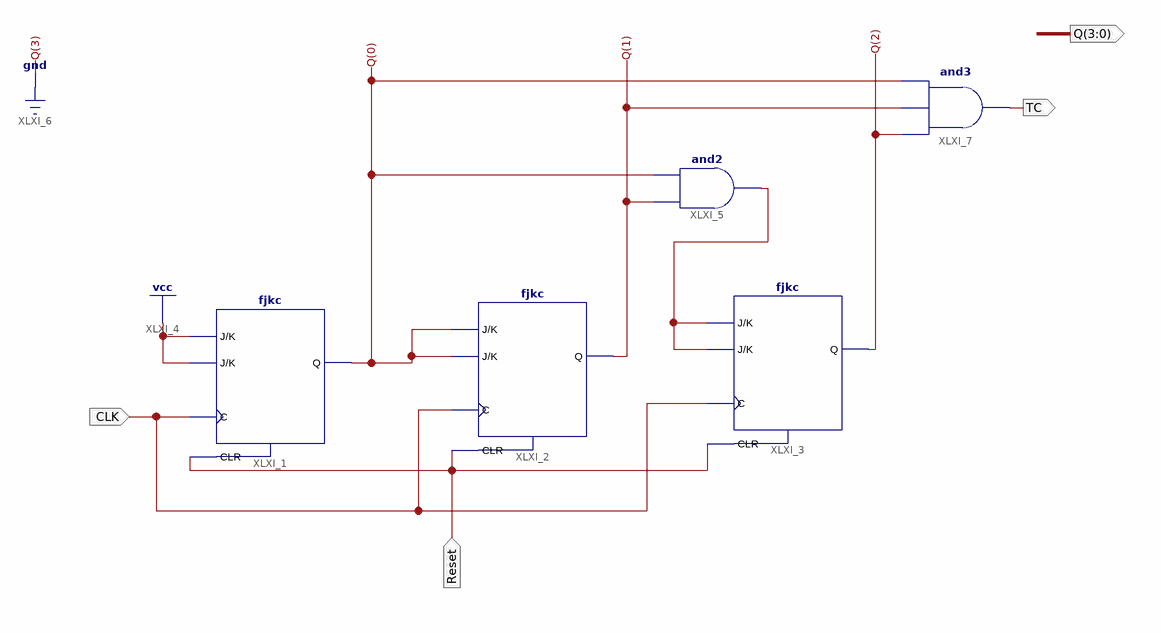
[diagram p0: schematic sheet 1]
// Xilinx ISE schematic Counter0_7.sch (spartan6) as structural Verilog: 5 symbols, 4 ports
module Counter0_7 (
  input  CLK,
  input  Reset,
  output [3:0] Q,
  output TC
);

  wire XLXN_5;

  fjkc XLXI_1 (.C(CLK), .CLR(Reset), .J(1'b1), .K(1'b1), .Q(Q[0]));
  fjkc XLXI_2 (.C(CLK), .CLR(Reset), .J(Q[0]), .K(Q[0]), .Q(Q[1]));
  fjkc XLXI_3 (.C(CLK), .CLR(Reset), .J(XLXN_5), .K(XLXN_5), .Q(Q[2]));
  and XLXI_5 (XLXN_5, Q[1], Q[0]);
  and XLXI_7 (TC, Q[2], Q[1], Q[0]);

  assign Q[3] = 1'b0;
endmodule
